# EAGLE design tconnectors (EAGLE 9.6.1)
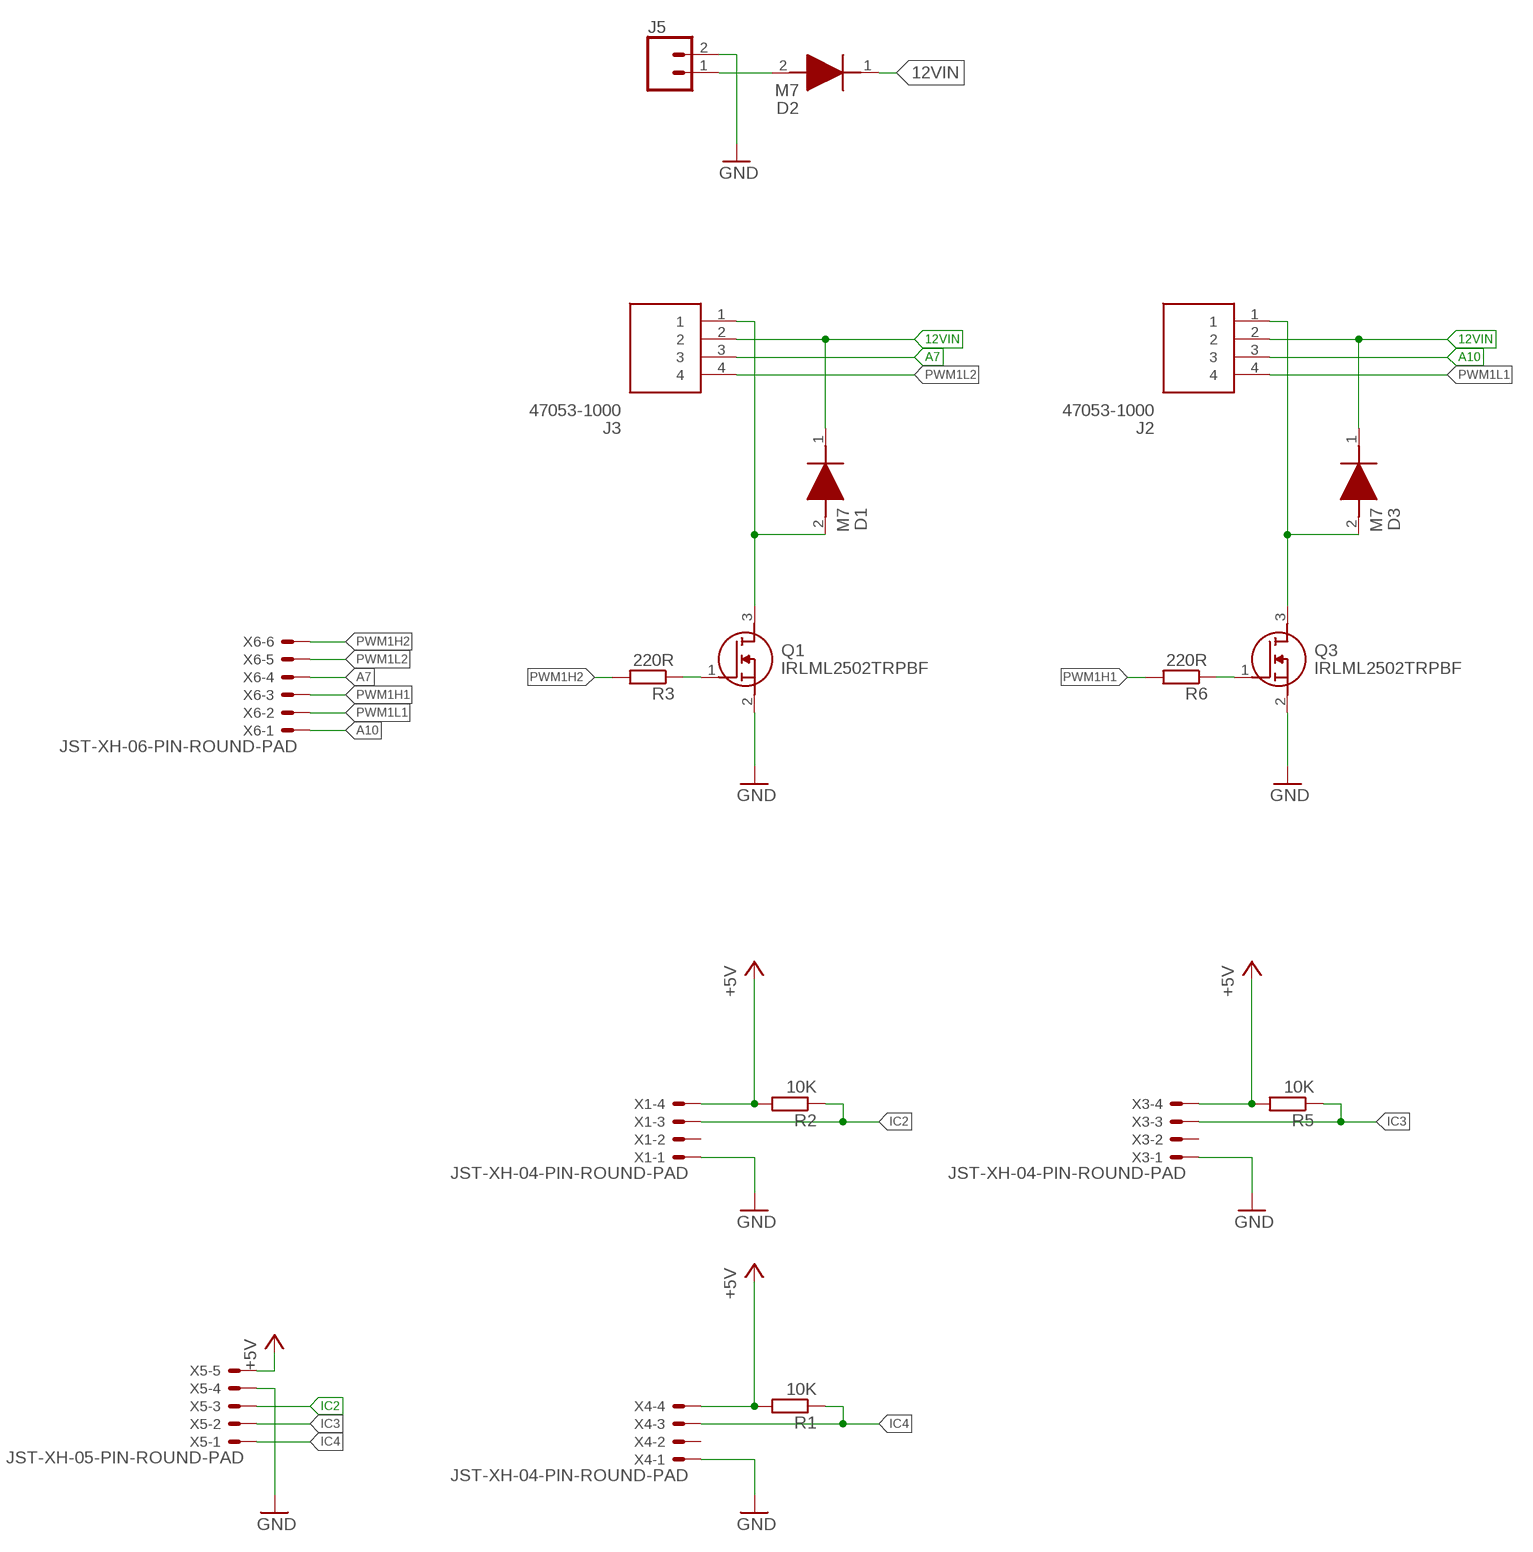
[diagram p0: schematic, sheet 1]

## Parts
D1  M7  [DIOM5327X240N]
D2  M7  [DIOM5327X240N]
D3  M7  [DIOM5327X240N]
J2  47053-1000  [470531000]
J3  47053-1000  [470531000]
J5  CONN_025MM  [SCREWTERMINAL-5MM-2]
Q1  IRLML2502TRPBF  [SOT95P237X112-3N]
Q3  IRLML2502TRPBF  [SOT95P237X112-3N]
R1  10K  R-EU_R0805  [R0805]
R2  10K  R-EU_R0805  [R0805]
R3  220R  R-EU_R0805  [R0805]
R5  10K  R-EU_R0805  [R0805]
R6  220R  R-EU_R0805  [R0805]
X1  JST-XH-04-PIN-ROUND-PAD  [JST-XH-04-PACKAGE-ROUND-PAD]
X3  JST-XH-04-PIN-ROUND-PAD  [JST-XH-04-PACKAGE-ROUND-PAD]
X4  JST-XH-04-PIN-ROUND-PAD  [JST-XH-04-PACKAGE-ROUND-PAD]
X5  JST-XH-05-PIN-ROUND-PAD  [JST-XH-05-PACKAGE-ROUND-PAD]
X6  JST-XH-06-PIN-ROUND-PAD  [JST-XH-06-PACKAGE-ROUND-PAD]

## Nets
12VIN [logic]: D1.1(K) D2.1(K) D3.1(K) J2.2 J3.2
+5V [power]: R1.2 R2.2 R5.2 X1.4 X3.4 X4.4 X5.5
A7 [logic]: J3.3 X6.4
A10 [logic]: J2.3 X6.1
GND [power]: J5.2 Q1.2(S) Q3.2(S) X1.1 X3.1 X4.1 X5.4
IC2 [logic]: R2.1 X1.3 X5.3
IC3 [logic]: R5.1 X3.3 X5.2
IC4 [logic]: R1.1 X4.3 X5.1
N$3 [power]: D1.2(A) J3.1 Q1.3(D)
N$4 [power]: D3.2(A) J2.1 Q3.3(D)
N$5: Q3.1(G) R6.1
N$7: Q1.1(G) R3.1
N$8 [logic]: D2.2(A) J5.1
PWM1H1 [logic]: R6.2 X6.3
PWM1H2 [logic]: R3.2 X6.6
PWM1L1 [logic]: J2.4 X6.2
PWM1L2 [logic]: J3.4 X6.5
Unconnected: X1.2 X3.2 X4.2

## Library data of the parts
D1-D3 = M7:M7: Standard recovery rectifier diode Source: Datasheet <https://www.mouser.in/datasheet/2/849/m1-2577421.pdf>; DESCRIPTION: Standard recovery rectifier diode; HEIGHT: 2.4mm; MANUFACTURER_NAME: Diotec; MANUFACTURER_PART_NUMBER: M7; MOUSER_PART_NUMBER: 637-M7; MOUSER_PRICE-STOCK: https://www.mouser.co.uk/ProductDetail/Diotec-Semiconductor/M7?qs=OlC7AqGiEDln9itgkDD%2F2A%3D%3D
J2 J3 = 47053-1000:47053-1000: MOLEX - 47053-1000 - HEADER, 4POS, 1ROW, 2.54MM Source: Datasheet <http://www.molex.com/pdm_docs/sd/470531000_sd.pdf>; DESCRIPTION: MOLEX - 47053-1000 - HEADER, 4POS, 1ROW, 2.54MM; HEIGHT: 8mm; MANUFACTURER_NAME: Molex; MANUFACTURER_PART_NUMBER: 47053-1000; MOUSER_PART_NUMBER: 538-47053-1000; MOUSER_PRICE-STOCK: https://www.mouser.co.uk/ProductDetail/Molex/47053-1000?qs=ph4zPCVRuvqoDX7hrEhxNA%3D%3D
J5 = SparkFun-Connectors:CONN_02: Multi connection point. Often used as Generic Header-pin footprint for 0.1 inch spaced/style header connections On any of the 0.1 inch spaced packages, you can populate with these: Break Away Headers - Straight <https://www.sparkfun.com/products/116> (PRT-00116) Break Away Male Headers - Right Angle <https://www.sparkfun.com/products/553> (PRT-00553) Female Headers <https://www.sparkfun.com/products/115> (PRT-00115) Break Away Headers - Machine Pin <https://www.sparkfun.com/products/117> (PRT-00117) Break Away Female Headers - Swiss Machine Pin <https://www.sparkfun.com/products/743> (PRT-00743) For SCREWTERMINALS and SPRING TERMINALS visit here: Screw Terimnals on SparkFun.com <https://www.sparkfun.com/search/results?term=Screw+Terminals> (5mm/3.5mm/2.54mm spacing) This device is also useful as a general connection point to wire up your design to another part of your project. Our various solder wires solder well into these plated through hole pads. Hook-Up Wire - Assortment (Stranded, 22 AWG) <https://www.sparkfun.com/products/11375> (PRT-11375) Hook-Up Wire - Assortment (Solid Core, 22 AWG) <https://www.sparkfun.com/products/11367> (PRT-11367) View the entire wire category on our website here <https://www.sparkfun.com/categories/141> Special notes: Molex polarized connector foot print use with: PRT-08233 with associated crimp pins and housings. 2.54_SCREWTERM for use with PRT-10571. 3.5mm Screw Terminal footprints for PRT-08084 5mm Screw Terminal footprints for use with PRT-08432; SF_SKU: PRT-08432
Q1 Q3 = IRLML2502TRPBF:IRLML2502TRPBF: IRLML2502TRPBF N-Channel MOSFET, 4.2 A, 20 V IRLML2502, 3-Pin SOT-23 Infineon Source: Datasheet; DESCRIPTION: IRLML2502TRPBF N-Channel MOSFET, 4.2 A, 20 V IRLML2502, 3-Pin SOT-23 Infineon; HEIGHT: 1.12mm; MANUFACTURER_NAME: Infineon; MANUFACTURER_PART_NUMBER: IRLML2502TRPBF; MOUSER_PART_NUMBER: 942-IRLML2502TRPBF; MOUSER_PRICE-STOCK: https://www.mouser.co.uk/ProductDetail/Infineon-Technologies/IRLML2502TRPBF?qs=9%252BKlkBgLFf37zQw9UlZd%2FQ%3D%3D
R1-R3 R5 R6 = rcl:R-EU_: RESISTOR, European symbol; SPICEPREFIX: R
X1 X3 X4 = Rembrandt Electronics - JST XH Connectors v1-0:JST-XH-04-PIN: JST XH Connector 2 Pin Wire to board connector. Pitch: 2,54 mm, (0.100") Number of pins: 4 Created by Rembrandt Electronics www.rembrandtelectronics.com
X5 = Rembrandt Electronics - JST XH Connectors v1-0:JST-XH-05-PIN: JST XH Connector 2 Pin Wire to board connector. Pitch: 2,54 mm, (0.100") Number of pins: 5 Created by Rembrandt Electronics www.rembrandtelectronics.com
X6 = Rembrandt Electronics - JST XH Connectors v1-0:JST-XH-06-PIN: JST XH Connector 2 Pin Wire to board connector. Pitch: 2,54 mm, (0.100") Number of pins: 6 Created by Rembrandt Electronics www.rembrandtelectronics.com

## Net classes
0 default: width 0.203 mm, drill 0.254 mm, clearance 0.203 mm
1 logic: width 0.203 mm, drill 0.254 mm, clearance 0.203 mm
2 power: width 0.406 mm, drill 0.254 mm, clearance 0.203 mm

## Board
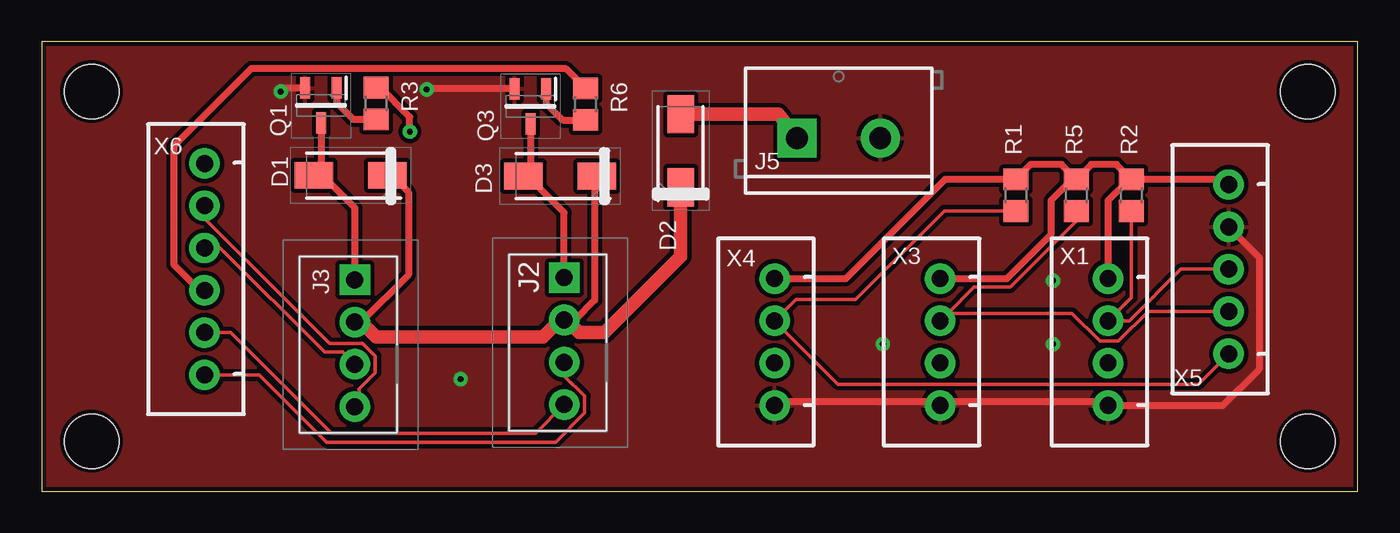
[diagram p1: board, top side]
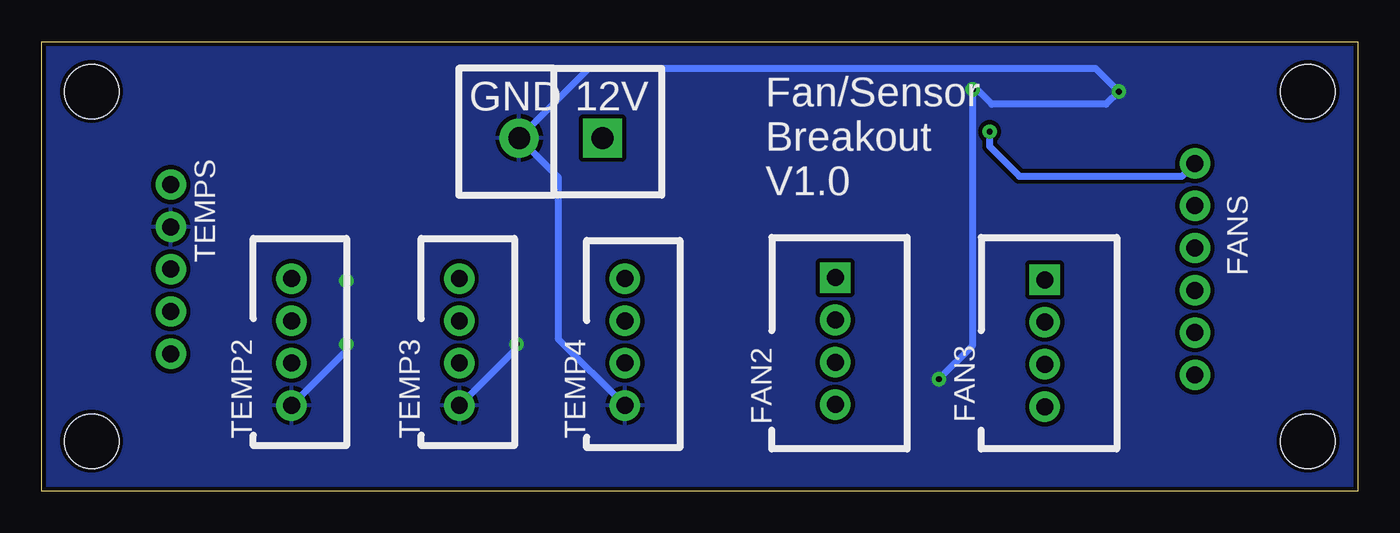
[diagram p2: board, bottom side, seen from below]

Size 79 x 27 mm. Coordinates in mm from the lower left corner, seen from the top.
Outline: 0,0 79,0 79,27 0,27 0,0
Copper layers (1*16): Top 0.035mm / dielectric 1.6mm / Bottom 0.035mm
Design rules "angelo-jlcpcb-2layers": minimum track width 8mil, minimum drill 0.3mm, track to track 6mil, track to pad 6mil, pad to pad 6mil, via to via 10mil, smd to smd 6mil, copper to edge 0.2mm, drill to drill 8mil, minimum pad ring 10mil, minimum via ring 10mil, stop-mask expansion 4mil, vias tented up to drill 0mil, thermal gap 10mil
Holes 3.25 mm at 76,24 3,3 3,24 76,3

### Footprints (pad centres in the part's own frame; a part is rotated, then mirrored left to right if it is on the bottom)
DIOM5327X240N = smd 2.3 x 1.6: 1 -2.2,0; 2 2.2,0
470531000 = drill 1.02 pad 1.53 square: 1 0,0 | drill 1.02 pad 1.55: 2 -2.54,0; 3 -5.08,0; 4 -7.62,0
SCREWTERMINAL-5MM-2 = drill 1.3 pad 2.032 square: 1 0,0 | drill 1.3 pad 2.032: 2 5,0
SOT95P237X112-3N = smd 1.3 x 0.6: 1 -1.05,0.95; 2 -1.05,-0.95; 3 1.05,0
R0805 = smd 1.3 x 1.5: 1 -0.95,0; 2 0.95,0
JST-XH-04-PACKAGE-ROUND-PAD = drill 1.016: 1 -3.81,0; 2 -1.27,0; 3 1.27,0; 4 3.81,0
JST-XH-05-PACKAGE-ROUND-PAD = drill 1.016: 1 -5.08,0; 2 -2.54,0; 3 0,0; 4 2.54,0; 5 5.08,0
JST-XH-06-PACKAGE-ROUND-PAD = drill 1.016: 1 -6.35,0; 2 -3.81,0; 3 -1.27,0; 4 1.27,0; 5 3.81,0; 6 6.35,0

### Placement (x,y rotation side)
D1  18.54,18.97 180 top
D2  38.35,20.45 90 top
D3  31.11,18.92 180 top
J2  31.37,12.83 90 top
J3  18.8,12.7 90 top
J5  45.34,21.21 0 top
Q1  16.76,23.16 270 top
Q3  29.34,23.11 270 top
R1  58.47,17.78 90 top
R2  65.41,17.78 90 top
R3  20.07,23.29 90 top
R5  62.1,17.78 90 top
R6  32.64,23.24 90 top
X1  64.01,8.96 90 top
X3  53.93,8.96 90 top
X4  44,8.96 90 top
X5  71.25,13.34 90 top
X6  9.78,13.34 90 top

### Tracks (layer width: path | path; a pad name or v marks a point on that pad's centre or on a via)
12VIN
  Top 0.406: D1.1 21,18.97 22.01,17.95 22.01,12.99 19.18,10.16 J3.2 | D3.1 33.19,18.8 33.19,11.47 32,10.29 J2.2
  Top 0.813: D2.1 38.35,14.1 33.78,9.53 32.26,9.53 31.5,10.29 J2.2 31.11,10.29 30.1,9.27 20.07,9.27 19.18,10.16
+5V
  Top 0.406: X5.5 70.93,18.73 R2.2 | R5.2 62.99,19.62 64.52,19.62 R2.2 | R5.2 61.21,19.62 59.36,19.62 R1.2 54.22,18.73 48.26,12.77 X4.4 | R5.2 61.85,18.48 61.59,18.48 60.58,17.46 60.58,15.42 57.93,12.77 X3.4 | R2.2 65.28,18.73 64.01,17.46 X1.4
A7
  Top 0.203: X6.4 10.73,14.61 16.98,8.36 18.06,8.36 J3.3
A10
  Top 0.203: X6.1 13.06,6.99 17.11,2.94 30.83,2.94 32.59,4.7 32.59,5.71 31.37,6.94 J2.3
GND  (via drill 0.35)
  Top 0.406: X4.1 44.2,5.35 53.73,5.35 X3.1 54.13,5.35 63.81,5.35 X1.1 64.03,5.13 70.88,5.13 73.08,7.33 73.08,14.05 X5.4 | Q3.2 23.15,24.16 v23.11,24.13 | Q1.2 14.56,24.21 v14.35,24
  Bottom 0.406: X4.1 47.99,9.15 47.99,18.86 J5.2 46.15,25.4 15.75,25.4 v14.35,24 15.11,23.24 21.97,23.24 22.99,24.26 v23.11,24.13 23.11,8.76 v25.15,6.73 | X1.1 60.71,8.46 v60.71,8.84 v60.71,12.65 | X3.1 50.5,8.58 v50.5,8.84
  pour Top (isolate 0.254, rank 2): 0,0 0,27 79,27 79,0
  pour Bottom (isolate 0.254): 0,0 0,27 79,27 79,0
IC2
  Top 0.203: X5.3 68.38,13.34 65.28,10.23 X1.3 65.41,11.63 R2.1
IC3
  Top 0.203: X3.3 54.38,10.69 | 54.38,10.69 55.96,12.27 58.14,12.27 62.1,16.23 R5.1 | X5.2 66.42,10.79 64.63,9.01 63.5,9.01 61.83,10.69 54.38,10.69
IC4
  Top 0.203: X5.1 69.42,6.42 47.81,6.42 X4.3 45.27,11.5 48.86,11.5 54.18,16.83 R1.1
N$3
  Top 0.406: J3.1 18.8,17.02 16.85,18.97 D1.2 16.39,18.93 16.76,19.3 Q1.3
N$4
  Top 0.406: J2.1 31.37,16.72 29.17,18.92 D3.2 29.34,19.34 Q3.3
N$5
  Top 0.406: Q3.1 30.29,23.27 31.27,22.29 R6.1
N$7
  Top 0.406: Q1.1 17.71,23.32 18.7,22.34 R3.1
N$8
  Top 0.813: J5.1 45.34,21.27 44.22,22.65 D2.2
PWM1H1
  Top 0.406: X6.3 9.47,12.06 7.95,13.59 7.95,20.75 12.6,25.4 31.43,25.4 R6.2
PWM1H2  (via drill 0.35)
  Top 0.406: v22.1,21.59 22.1,22.48 20.34,24.24 R3.2
  Bottom 0.406: X6.6 10.54,18.92 20.32,18.92 22.1,20.7 v22.1,21.59
PWM1L1
  Top 0.203: J2.4 29.64,3.48 17.4,3.48 11.35,9.53 X6.2
PWM1L2
  Top 0.203: X6.5 9.78,16.38 17.27,8.89 19.25,8.89 20.02,8.13 20.02,7.11 19.05,6.14 19.05,5.08 J3.4

### Text on the board
bPlace: 12V | GND | TEMPS | FANS | Fan/Sensor / Breakout / V1.0 | FAN3 | FAN2 | TEMP4 | TEMP3 | TEMP2